# Altium schematic sheet CapArray.SchDoc
size A4; SheetNumber: 1; SheetTotal: 1
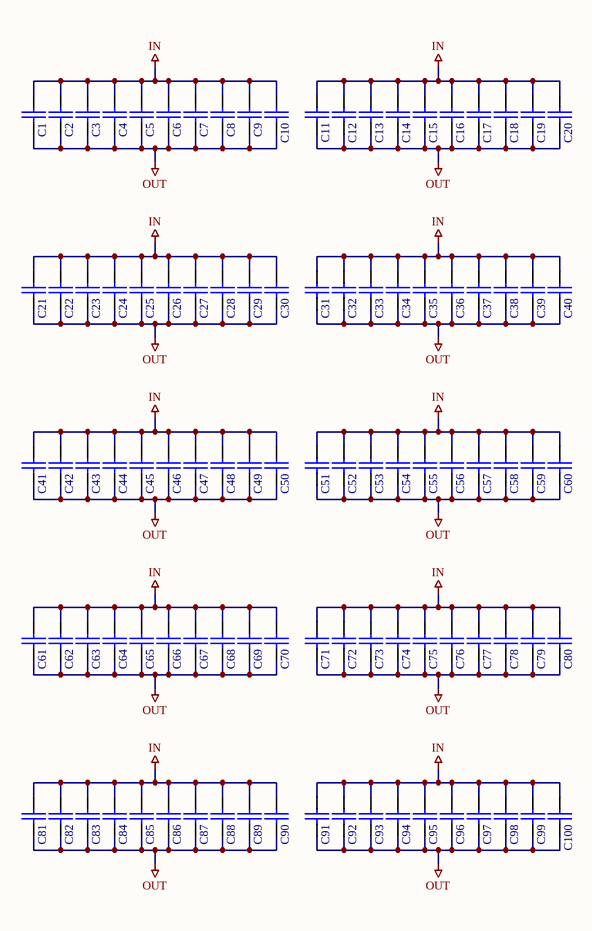
[diagram p0: CapArray.SchDoc]

## Parts
C1  CAP  [1206C]  (value not drawn)
C2  CAP  [1206C]  (value not drawn)
C3  CAP  [1206C]  (value not drawn)
C4  CAP  [1206C]  (value not drawn)
C5  CAP  [1206C]  (value not drawn)
C6  CAP  [1206C]  (value not drawn)
C7  CAP  [1206C]  (value not drawn)
C8  CAP  [1206C]  (value not drawn)
C9  CAP  [1206C]  (value not drawn)
C10  CAP  [1206C]  (value not drawn)
C11  CAP  [1206C]  (value not drawn)
C12  CAP  [1206C]  (value not drawn)
C13  CAP  [1206C]  (value not drawn)
C14  CAP  [1206C]  (value not drawn)
C15  CAP  [1206C]  (value not drawn)
C16  CAP  [1206C]  (value not drawn)
C17  CAP  [1206C]  (value not drawn)
C18  CAP  [1206C]  (value not drawn)
C19  CAP  [1206C]  (value not drawn)
C20  CAP  [1206C]  (value not drawn)
C21  CAP  [1206C]  (value not drawn)
C22  CAP  [1206C]  (value not drawn)
C23  CAP  [1206C]  (value not drawn)
C24  CAP  [1206C]  (value not drawn)
C25  CAP  [1206C]  (value not drawn)
C26  CAP  [1206C]  (value not drawn)
C27  CAP  [1206C]  (value not drawn)
C28  CAP  [1206C]  (value not drawn)
C29  CAP  [1206C]  (value not drawn)
C30  CAP  [1206C]  (value not drawn)
C31  CAP  [1206C]  (value not drawn)
C32  CAP  [1206C]  (value not drawn)
C33  CAP  [1206C]  (value not drawn)
C34  CAP  [1206C]  (value not drawn)
C35  CAP  [1206C]  (value not drawn)
C36  CAP  [1206C]  (value not drawn)
C37  CAP  [1206C]  (value not drawn)
C38  CAP  [1206C]  (value not drawn)
C39  CAP  [1206C]  (value not drawn)
C40  CAP  [1206C]  (value not drawn)
C41  CAP  [1206C]  (value not drawn)
C42  CAP  [1206C]  (value not drawn)
C43  CAP  [1206C]  (value not drawn)
C44  CAP  [1206C]  (value not drawn)
C45  CAP  [1206C]  (value not drawn)
C46  CAP  [1206C]  (value not drawn)
C47  CAP  [1206C]  (value not drawn)
C48  CAP  [1206C]  (value not drawn)
C49  CAP  [1206C]  (value not drawn)
C50  CAP  [1206C]  (value not drawn)
C51  CAP  [1206C]  (value not drawn)
C52  CAP  [1206C]  (value not drawn)
C53  CAP  [1206C]  (value not drawn)
C54  CAP  [1206C]  (value not drawn)
C55  CAP  [1206C]  (value not drawn)
C56  CAP  [1206C]  (value not drawn)
C57  CAP  [1206C]  (value not drawn)
C58  CAP  [1206C]  (value not drawn)
C59  CAP  [1206C]  (value not drawn)
C60  CAP  [1206C]  (value not drawn)
C61  CAP  [1206C]  (value not drawn)
C62  CAP  [1206C]  (value not drawn)
C63  CAP  [1206C]  (value not drawn)
C64  CAP  [1206C]  (value not drawn)
C65  CAP  [1206C]  (value not drawn)
C66  CAP  [1206C]  (value not drawn)
C67  CAP  [1206C]  (value not drawn)
C68  CAP  [1206C]  (value not drawn)
C69  CAP  [1206C]  (value not drawn)
C70  CAP  [1206C]  (value not drawn)
C71  CAP  [1206C]  (value not drawn)
C72  CAP  [1206C]  (value not drawn)
C73  CAP  [1206C]  (value not drawn)
C74  CAP  [1206C]  (value not drawn)
C75  CAP  [1206C]  (value not drawn)
C76  CAP  [1206C]  (value not drawn)
C77  CAP  [1206C]  (value not drawn)
C78  CAP  [1206C]  (value not drawn)
C79  CAP  [1206C]  (value not drawn)
C80  CAP  [1206C]  (value not drawn)
C81  CAP  [1206C]  (value not drawn)
C82  CAP  [1206C]  (value not drawn)
C83  CAP  [1206C]  (value not drawn)
C84  CAP  [1206C]  (value not drawn)
C85  CAP  [1206C]  (value not drawn)
C86  CAP  [1206C]  (value not drawn)
C87  CAP  [1206C]  (value not drawn)
C88  CAP  [1206C]  (value not drawn)
C89  CAP  [1206C]  (value not drawn)
C90  CAP  [1206C]  (value not drawn)
C91  CAP  [1206C]  (value not drawn)
C92  CAP  [1206C]  (value not drawn)
C93  CAP  [1206C]  (value not drawn)
C94  CAP  [1206C]  (value not drawn)
C95  CAP  [1206C]  (value not drawn)
C96  CAP  [1206C]  (value not drawn)
C97  CAP  [1206C]  (value not drawn)
C98  CAP  [1206C]  (value not drawn)
C99  CAP  [1206C]  (value not drawn)
C100  CAP  [1206C]  (value not drawn)

## Nets
IN: C1.1 C2.1 C3.1 C4.1 C5.1 C6.1 C7.1 C8.1 C9.1 C10.1 C11.1 C12.1 C13.1 C14.1 C15.1 C16.1 C17.1 C18.1 C19.1 C20.1 C21.1 C22.1 C23.1 C24.1 C25.1 C26.1 C27.1 C28.1 C29.1 C30.1 C31.1 C32.1 C33.1 C34.1 C35.1 C36.1 C37.1 C38.1 C39.1 C40.1 C41.1 C42.1 C43.1 C44.1 C45.1 C46.1 C47.1 C48.1 C49.1 C50.1 C51.1 C52.1 C53.1 C54.1 C55.1 C56.1 C57.1 C58.1 C59.1 C60.1 C61.1 C62.1 C63.1 C64.1 C65.1 C66.1 C67.1 C68.1 C69.1 C70.1 C71.1 C72.1 C73.1 C74.1 C75.1 C76.1 C77.1 C78.1 C79.1 C80.1 C81.1 C82.1 C83.1 C84.1 C85.1 C86.1 C87.1 C88.1 C89.1 C90.1 C91.1 C92.1 C93.1 C94.1 C95.1 C96.1 C97.1 C98.1 C99.1 C100.1
OUT: C1.2 C2.2 C3.2 C4.2 C5.2 C6.2 C7.2 C8.2 C9.2 C10.2 C11.2 C12.2 C13.2 C14.2 C15.2 C16.2 C17.2 C18.2 C19.2 C20.2 C21.2 C22.2 C23.2 C24.2 C25.2 C26.2 C27.2 C28.2 C29.2 C30.2 C31.2 C32.2 C33.2 C34.2 C35.2 C36.2 C37.2 C38.2 C39.2 C40.2 C41.2 C42.2 C43.2 C44.2 C45.2 C46.2 C47.2 C48.2 C49.2 C50.2 C51.2 C52.2 C53.2 C54.2 C55.2 C56.2 C57.2 C58.2 C59.2 C60.2 C61.2 C62.2 C63.2 C64.2 C65.2 C66.2 C67.2 C68.2 C69.2 C70.2 C71.2 C72.2 C73.2 C74.2 C75.2 C76.2 C77.2 C78.2 C79.2 C80.2 C81.2 C82.2 C83.2 C84.2 C85.2 C86.2 C87.2 C88.2 C89.2 C90.2 C91.2 C92.2 C93.2 C94.2 C95.2 C96.2 C97.2 C98.2 C99.2 C100.2

## Library data of the parts
C1-C100 = CAP: 100uF,25V